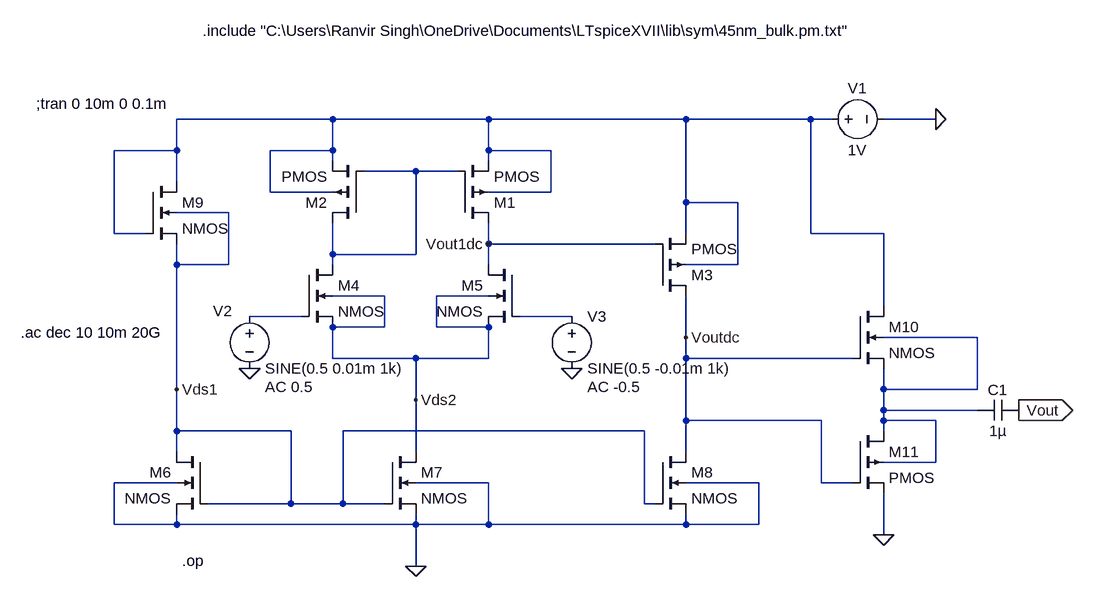
[diagram p0: schematic OPAMP.asc]
OPAMP.asc, the LTspice schematic file:
Version 4
SHEET 1 1104 680
WIRE -64 -192 -304 -192
WIRE 176 -192 -64 -192
WIRE 480 -192 176 -192
WIRE 672 -192 480 -192
WIRE 704 -192 672 -192
WIRE 864 -192 784 -192
WIRE -304 -144 -304 -192
WIRE -304 -144 -400 -144
WIRE -64 -144 -64 -192
WIRE -64 -144 -160 -144
WIRE 176 -144 176 -192
WIRE 272 -144 176 -144
WIRE -64 -128 -64 -144
WIRE 176 -128 176 -144
WIRE 64 -112 -16 -112
WIRE 128 -112 64 -112
WIRE -304 -96 -304 -144
WIRE -160 -80 -160 -144
WIRE -64 -80 -160 -80
WIRE 272 -80 272 -144
WIRE 272 -80 176 -80
WIRE 480 -64 480 -192
WIRE 560 -64 480 -64
WIRE -224 -48 -304 -48
WIRE -400 -16 -400 -144
WIRE -352 -16 -400 -16
WIRE 480 -16 480 -64
WIRE 672 -16 672 -192
WIRE 784 -16 672 -16
WIRE 176 0 176 -32
WIRE 432 0 176 0
WIRE -64 16 -64 -32
WIRE 64 16 64 -112
WIRE 64 16 -64 16
WIRE -304 32 -304 0
WIRE -224 32 -224 -48
WIRE -224 32 -304 32
WIRE -64 32 -64 16
WIRE 176 32 176 0
WIRE 560 32 560 -64
WIRE 560 32 480 32
WIRE 16 80 -64 80
WIRE 176 80 96 80
WIRE 784 96 784 -16
WIRE -112 112 -192 112
WIRE 304 112 224 112
WIRE 16 128 16 80
WIRE 16 128 -64 128
WIRE 96 128 96 80
WIRE 176 128 96 128
WIRE 480 144 480 80
WIRE 928 144 784 144
WIRE -64 176 -64 128
WIRE 64 176 -64 176
WIRE 176 176 176 128
WIRE 176 176 64 176
WIRE 480 176 480 144
WIRE 736 176 480 176
WIRE -304 224 -304 32
WIRE 784 224 784 192
WIRE 928 224 928 144
WIRE 928 224 784 224
WIRE 64 240 64 176
WIRE 784 256 784 224
WIRE 928 256 784 256
WIRE 480 272 480 176
WIRE 688 272 480 272
WIRE 784 272 784 256
WIRE 864 272 784 272
WIRE -304 288 -304 224
WIRE -128 288 -304 288
WIRE 416 288 -48 288
WIRE 784 288 784 272
WIRE -304 320 -304 288
WIRE 64 320 64 240
WIRE 480 320 480 272
WIRE 864 336 864 272
WIRE 864 336 784 336
WIRE -304 368 -400 368
WIRE 176 368 64 368
WIRE 592 368 480 368
WIRE 688 368 688 272
WIRE 736 368 688 368
WIRE -128 400 -128 288
WIRE -128 400 -256 400
WIRE -48 400 -48 288
WIRE -48 400 -128 400
WIRE 16 400 -48 400
WIRE 416 400 416 288
WIRE 432 400 416 400
WIRE -400 432 -400 368
WIRE -304 432 -304 416
WIRE -304 432 -400 432
WIRE 64 432 64 416
WIRE 64 432 -304 432
WIRE 176 432 176 368
WIRE 176 432 64 432
WIRE 480 432 480 416
WIRE 480 432 176 432
WIRE 592 432 592 368
WIRE 592 432 480 432
WIRE 784 448 784 384
WIRE 64 496 64 432
FLAG 64 496 0
FLAG -192 192 0
FLAG 304 192 0
FLAG 176 0 Vout1dc
FLAG -304 224 Vds1
FLAG 64 240 Vds2
FLAG 480 144 Voutdc
FLAG 864 -192 0
FLAG 784 448 0
FLAG 992 256 Vout
IOPIN 992 256 Out
SYMBOL voltage 688 -192 R270
WINDOW 0 32 56 VTop 2
WINDOW 3 -32 56 VBottom 2
WINDOW 123 0 0 Left 0
WINDOW 39 0 0 Left 0
SYMATTR InstName V1
SYMATTR Value 1V
SYMBOL pmos4 128 -32 M180
SYMATTR InstName M1
SYMATTR Value2 l=350n w=1400n
SYMBOL pmos4 -16 -32 R180
SYMATTR InstName M2
SYMATTR Value2 l=350n w=1400n
SYMBOL pmos4 432 80 M180
SYMATTR InstName M3
SYMATTR Value2 l=350n w=6400n
SYMBOL nmos4 -112 32 R0
SYMATTR InstName M4
SYMATTR Value2 l=350n w=2800n
SYMBOL nmos4 224 32 M0
SYMATTR InstName M5
SYMATTR Value2 l=350n w=2800n
SYMBOL nmos4 -256 320 M0
SYMATTR InstName M6
SYMATTR Value2 l=350n w=700n
SYMBOL nmos4 16 320 R0
SYMATTR InstName M7
SYMATTR Value2 l=350n w=700n
SYMBOL nmos4 432 320 R0
SYMATTR InstName M8
SYMATTR Value2 l=350n w=1400n
SYMBOL nmos4 -352 -96 R0
SYMATTR InstName M9
SYMATTR Value2 l=350n w=350n
SYMBOL voltage -192 96 R0
WINDOW 0 -56 7 Left 2
WINDOW 123 24 124 Left 2
WINDOW 39 0 0 Left 0
SYMATTR InstName V2
SYMATTR Value2 AC 0.5
SYMATTR Value SINE(0.5 0.01m 1k)
SYMBOL voltage 304 96 R0
WINDOW 123 24 124 Left 2
WINDOW 39 0 0 Left 0
SYMATTR Value2 AC -0.5
SYMATTR InstName V3
SYMATTR Value SINE(0.5 -0.01m 1k)
SYMBOL nmos4 736 96 R0
SYMATTR InstName M10
SYMATTR Value2 l=350n w=3500n
SYMBOL pmos4 736 288 R0
SYMATTR InstName M11
SYMATTR Value2 l=350n w=3500n
SYMBOL cap 992 240 R90
WINDOW 0 0 32 VBottom 2
WINDOW 3 32 32 VTop 2
SYMATTR InstName C1
SYMATTR Value 1µ
TEXT -296 488 Left 2 !.op
TEXT -520 -216 Left 2 !;tran 0 10m 0 0.1m
TEXT -544 136 Left 2 !.ac dec 10 10m 20G
TEXT -264 -328 Left 2 !.include "C:\\Users\\Ranvir Singh\\OneDrive\\Documents\\LTspiceXVII\\lib\\sym\\45nm_bulk.pm.txt"

The netlist it stands for:
* OPAMP.asc
V1 N001 0 1V
M1 Vout1dc N002 N001 N001 PMOS l=350n w=1400n
M2 N002 N002 N001 N001 PMOS l=350n w=1400n
M3 Voutdc Vout1dc N001 N001 PMOS l=350n w=6400n
M4 N002 N003 Vds2 Vds2 NMOS l=350n w=2800n
M5 Vout1dc N004 Vds2 Vds2 NMOS l=350n w=2800n
M6 Vds1 Vds1 0 0 NMOS l=350n w=700n
M7 Vds2 Vds1 0 0 NMOS l=350n w=700n
M8 Voutdc Vds1 0 0 NMOS l=350n w=1400n
M9 N001 N001 Vds1 Vds1 NMOS l=350n w=350n
V2 N003 0 SINE(0.5 0.01m 1k) AC 0.5
V3 N004 0 SINE(0.5 -0.01m 1k) AC -0.5
M10 N001 Voutdc N005 N005 NMOS l=350n w=3500n
M11 N005 Voutdc 0 N005 PMOS l=350n w=3500n
C1 Vout N005 1µ
.model NMOS NMOS
.model PMOS PMOS
.lib standard.mos
.op
;tran 0 10m 0 0.1m
.ac dec 10 10m 20G
.include "C:\Users\Ranvir Singh\OneDrive\Documents\LTspiceXVII\lib\sym\45nm_bulk.pm.txt"
.backanno
.end